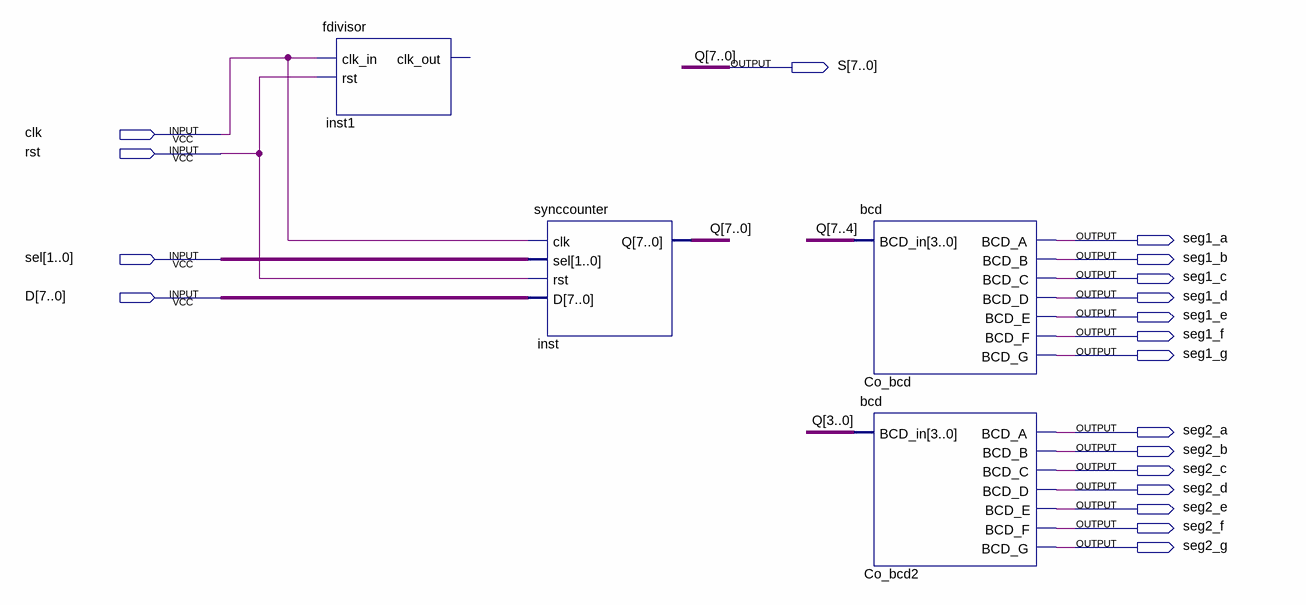
[diagram p0: schematic sheet]
// Quartus schematic lab06.bdf as structural Verilog: 4 symbols, 19 pins
module lab06 (
  input  clk,
  input  rst,
  input  [1:0] sel,
  input  [7:0] D,
  output [7:0] S,
  output seg1_a,
  output seg1_b,
  output seg1_c,
  output seg1_d,
  output seg1_e,
  output seg1_f,
  output seg1_g,
  output seg2_a,
  output seg2_b,
  output seg2_c,
  output seg2_d,
  output seg2_e,
  output seg2_f,
  output seg2_g
);

  fdivisor inst1 (.clk_in(clk), .rst(rst));  // open: clk_out
  synccounter inst (.clk(clk), .sel(sel), .rst(rst), .D(D), .Q(S));
  bcd Co_bcd (
    .BCD_in(S[7:4]), .BCD_A(seg1_a), .BCD_B(seg1_b), .BCD_C(seg1_c), .BCD_D(seg1_d), .BCD_E(seg1_e),
    .BCD_F(seg1_f), .BCD_G(seg1_g));
  bcd Co_bcd2 (
    .BCD_in(S[3:0]), .BCD_A(seg2_a), .BCD_B(seg2_b), .BCD_C(seg2_c), .BCD_D(seg2_d), .BCD_E(seg2_e),
    .BCD_F(seg2_f), .BCD_G(seg2_g));

  // Other names for the same wires on the sheet: Q[7:0] = S
endmodule
